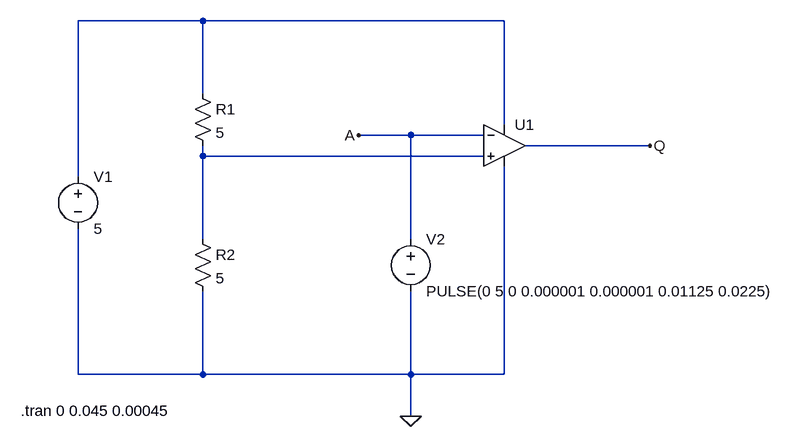
[diagram p0: schematic exercise2.asc]
exercise2.asc, the LTspice schematic file:
Version 4
SHEET 1 1116 680
WIRE 192 -96 0 -96
WIRE 656 -96 192 -96
WIRE 192 16 192 -96
WIRE 656 64 656 -96
WIRE 512 80 432 80
WIRE 624 80 512 80
WIRE 880 96 688 96
WIRE 192 112 192 96
WIRE 624 112 192 112
WIRE 0 144 0 -96
WIRE 192 240 192 112
WIRE 512 240 512 80
WIRE 0 448 0 224
WIRE 192 448 192 320
WIRE 192 448 0 448
WIRE 512 448 512 320
WIRE 512 448 192 448
WIRE 656 448 656 128
WIRE 656 448 512 448
WIRE 512 512 512 448
FLAG 432 80 A
FLAG 880 96 Q
FLAG 512 512 0
SYMBOL voltage 0 128 R0
WINDOW 123 0 0 Left 0
WINDOW 39 0 0 Left 0
SYMATTR InstName V1
SYMATTR Value 5
SYMBOL res 176 0 R0
SYMATTR InstName R1
SYMATTR Value 5
SYMBOL res 176 224 R0
SYMATTR InstName R2
SYMATTR Value 5
SYMBOL voltage 512 224 R0
WINDOW 123 0 0 Left 0
WINDOW 39 0 0 Left 0
SYMATTR InstName V2
SYMATTR Value PULSE(0 5 0 0.000001 0.000001 0.01125 0.0225)
SYMBOL OpAmps\\UniversalOpAmp2 656 96 R0
SYMATTR InstName U1
TEXT -88 504 Left 2 !.tran 0 0.045 0.00045

The netlist it stands for:
* exercise2.asc
V1 N001 0 5
R1 N001 N002 5
R2 N002 0 5
V2 A 0 PULSE(0 5 0 0.000001 0.000001 0.01125 0.0225)
XU1 N002 A N001 0 Q level2 Avol=1Meg GBW=10Meg Slew=10Meg Ilimit=25m Rail=0 Vos=0 En=0 Enk=0 In=0 Ink=0 Rin=500Meg  ; pins In+ In- V+ V- OUT
.tran 0 0.045 0.00045
.lib UniversalOpAmp2.lib
.backanno
.end